# Altium project CANSwitch_V2.PrjPcb
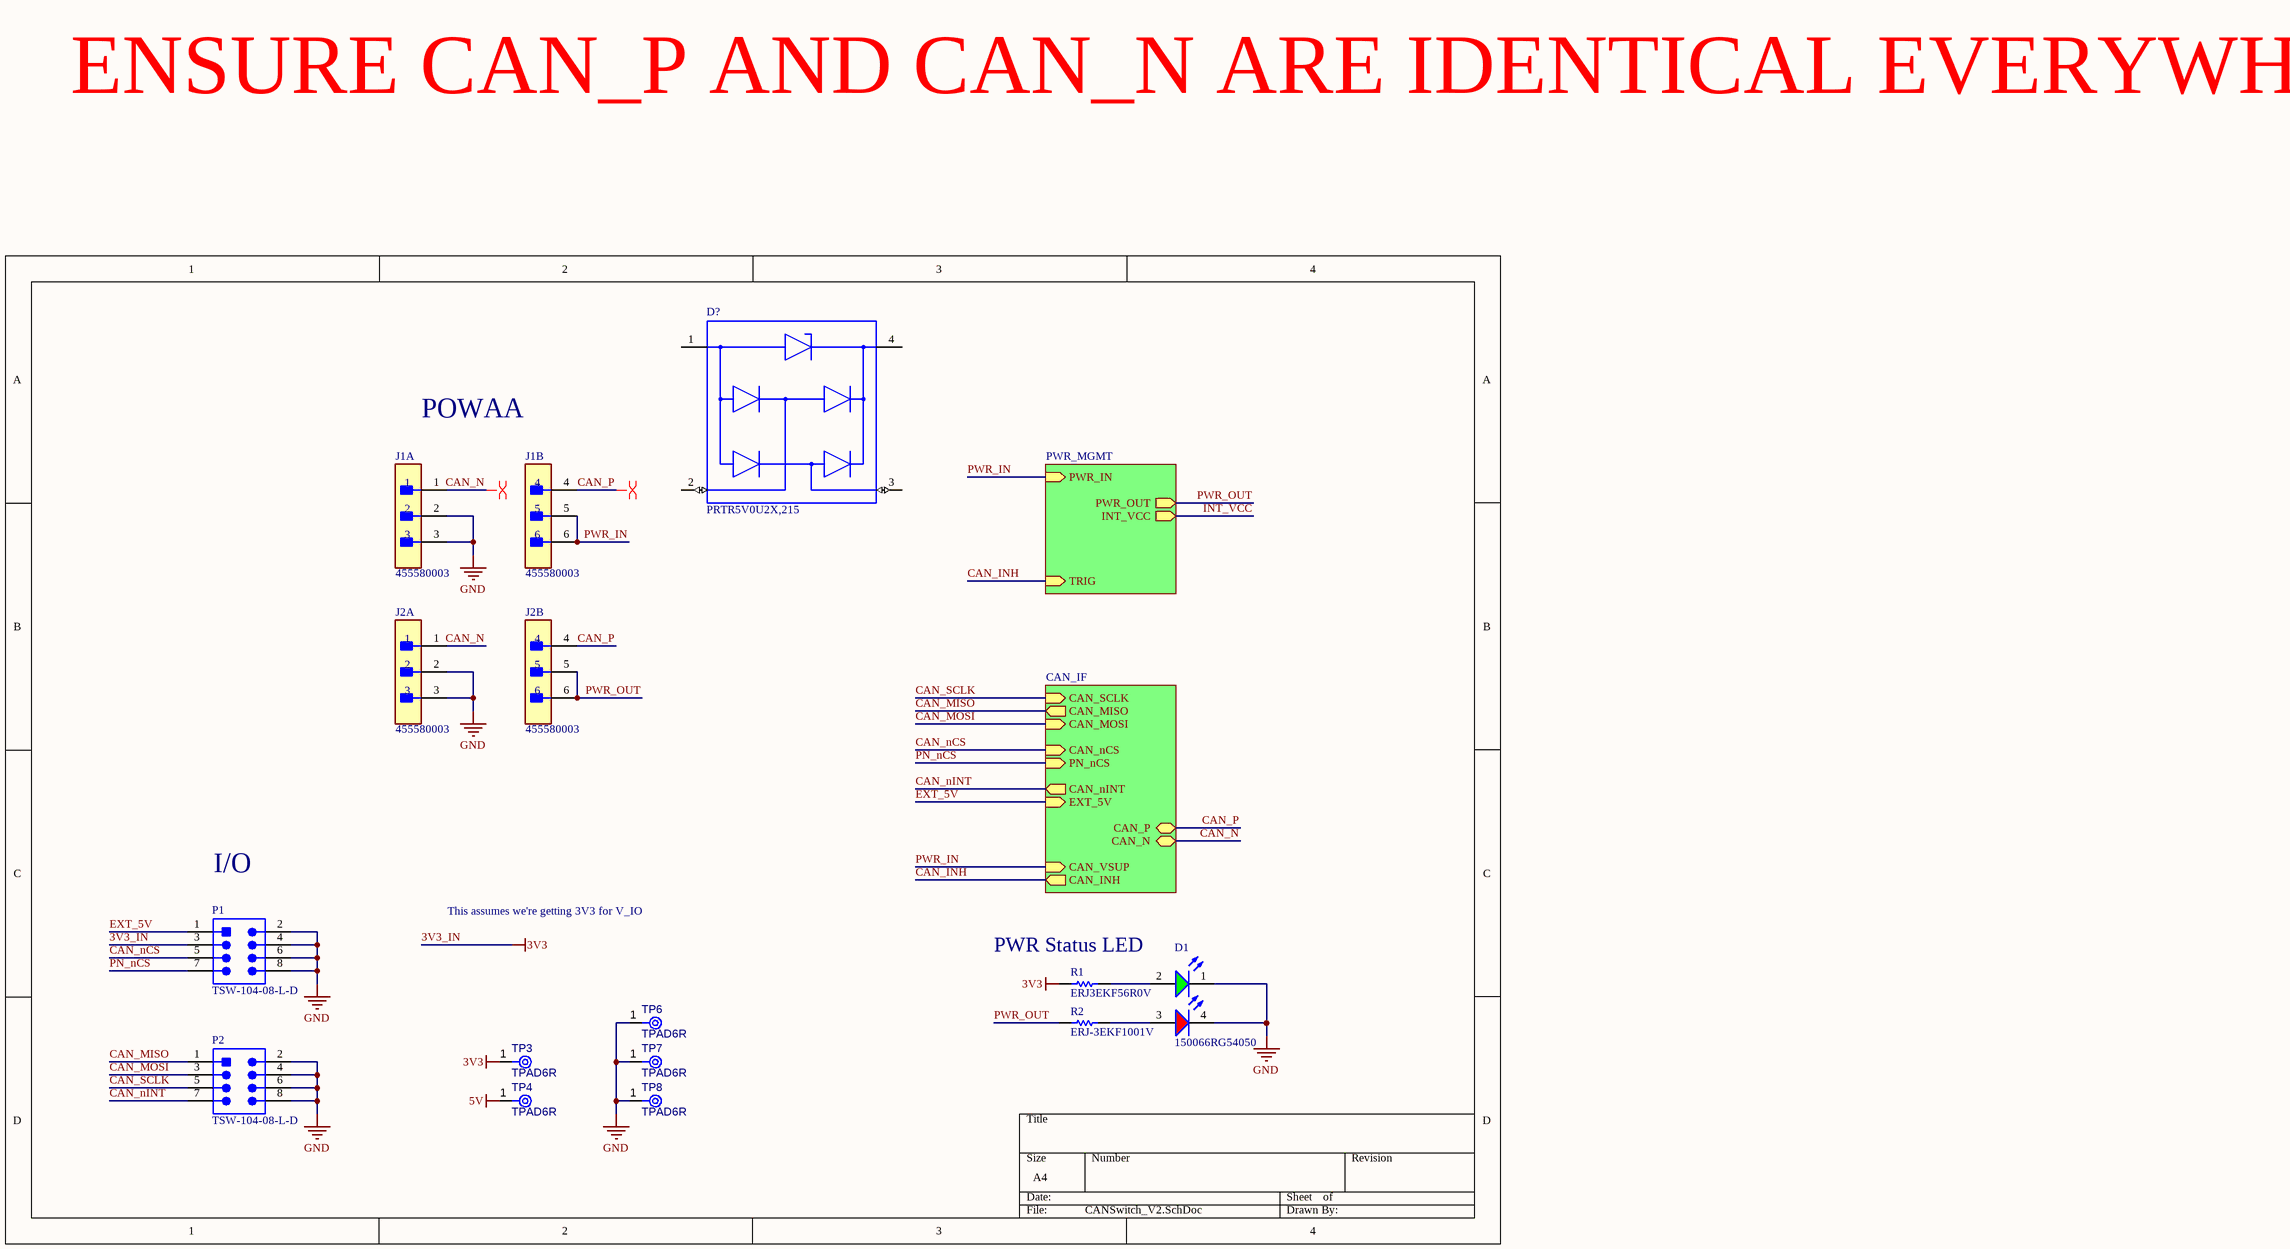
[diagram p0: CANSwitch_V2.SchDoc]
1 sheet, 13 parts. Net scope: hierarchical (ports join the sheet entries above them; power ports are global).
Board file: CANSwitch_V2.PcbDoc

## Sheet CANSwitch_V2.SchDoc
size A4; SheetNumber: 1; SheetTotal: 3

### Parts
D1  150066RG54050  [WL-SBCD_0606]
D?  PRTR5V0U2X,215  [FP-SOT143B-MFG]
J1  455580003  [FP-455580003-MFG]  (parts A,B of 2)
J2  455580003  [FP-455580003-MFG]  (parts A,B of 2)
P1  TSW-104-08-L-D  [SMTC-TSW-104-08-L-D_V]
P2  TSW-104-08-L-D  [SMTC-TSW-104-08-L-D_V]
R1  ERJ3EKF56R0V  [RESC1608X55X30NL15T15]
R2  ERJ-3EKF1001V  [RESC1608X55X30LL15T15]
TP3  TPAD6R  [TP06R]  (no BOM)
TP4  TPAD6R  [TP06R]  (no BOM)
TP6  TPAD6R  [TP06R]  (no BOM)
TP7  TPAD6R  [TP06R]  (no BOM)
TP8  TPAD6R  [TP06R]  (no BOM)

### Sub-sheets
CAN_0 = CAN_IF (file not in this document): CAN_SCLK (in), CAN_MISO (out), CAN_MOSI (in), CAN_nCS (in), CAN_INH (out), CAN_P (bidir), CAN_N (bidir), PN_nCS (in), CAN_nINT (out), EXT_5V (in), CAN_VSUP (in)
PWR_MGMT = PWR_MGMT (file not in this document): TRIG (in), PWR_OUT (out), PWR_IN (in), INT_VCC (out)

### Nets
3V3_IN: P1.3 R1.2 TP3.1(TP)  [also labelled 3V3]
5V: TP4.1(TP)
GND: D1.1(K) D1.4(K) J1.2 J1.3 J2.2 J2.3 P1.2 P1.4 P1.6 P1.8 P2.2 P2.4 P2.6 P2.8 TP6.1(TP) TP7.1(TP) TP8.1(TP)
CAN_INH: sheet CAN_0/CAN_INH, sheet PWR_MGMT/TRIG
CAN_MISO: P2.1 ; sheet CAN_0/CAN_MISO
CAN_MOSI: P2.3 ; sheet CAN_0/CAN_MOSI
CAN_N: J1.1 J2.1 ; sheet CAN_0/CAN_N
CAN_nCS: P1.5 ; sheet CAN_0/CAN_nCS
CAN_nINT: P2.7 ; sheet CAN_0/CAN_nINT
CAN_P: J1.4 J2.4 ; sheet CAN_0/CAN_P
CAN_SCLK: P2.5 ; sheet CAN_0/CAN_SCLK
EXT_5V: P1.1 ; sheet CAN_0/EXT_5V
INT_VCC: sheet PWR_MGMT/INT_VCC
PN_nCS: P1.7 ; sheet CAN_0/PN_nCS
PWR_IN: J1.5 J1.6 ; sheet CAN_0/CAN_VSUP, sheet PWR_MGMT/PWR_IN
PWR_OUT: J2.5 J2.6 R2.1 ; sheet PWR_MGMT/PWR_OUT
NetD1_2: D1.2(A) R1.1
NetD1_3: D1.3(A) R2.2

Not connected (* = marked no-connect by the designer): D? 1(GND) 2(I/O_1) 3(I/O_2) 4(VCC)

### Layout directives
differential pair: CAN_N, CAN_P

### Notes on the sheet
- ENSURE CAN_P AND CAN_N ARE IDENTICAL EVERYWHERE
- POWAA
- I/O
- This assumes we're getting 3V3 for V_IO
- (near R1) PWR Status LED

### Library data of the parts
D1 = CMP-004-00034-2: Led, Red/Grn, 180Mcd/230Mcd, 624Nm/525Nm Rohs Compliant: Yes
D? = CMP-14436-000007-1: TVS DIODE 5.5V SOT143B
J1 J2 = CMP-04776-000024-1: CONN HEADER R/A 6POS 4.2MM; Manufacturer: Molex; Standoff Height: 0.4mm; Conn Orientation: Right Angle; Number Of Contacts: 6; Conn Gender: Male; Voltage Rating: 600V; Current Rating: 8A; Footprint Url: https://www.molex.com/pdm_docs/sd/455580003_sd.pdf; Number Of Rows: 2; Lead Free: Yes; Digikey Description: CONN HEADER R/A 6POS 4.2MM; ComponentLink2URL: https://www.molex.com/webdocs/datasheets/pdf/en-us/0455580003_PCB_HEADERS.pdf; Octopart: https://octopart.com/45558-0003-molex-7672845; Package: 0; Device Class L3: unset; ComponentLink2Description: Datasheet; Device Class L2: Headers and Wire Housings; Category: Conn; Contact Material: Tin,Nickel; Mouser Description: Conn Power HDR 6 POS 4.2mm Solder ST Thru-Hole 6 Terminal 1 Port Mini-Fit Jr™ Tray; Manufacturer Part Number: 455580003; Pitch: 4.2mm; Device Class L1: Connectors; Temperature Range Low: -40°C; Temperature: -40°C to +105°C; RoHS: TRUE; Temperature Range High: +105°C; Height: 10.38mm; Automotive: No
P1 P2 = CMP-1681-00006-4: Male Header, Pitch 2.54 mm, 2 x 4 Position, Height 8.38 mm, Tail Length 5.08 mm, -55 to 125 degC, RoHS, Bulk; Manufacturer: Samtec; Voltage Rating: 550 V; Current Rating: 7.6 A; Rows: 2; ComponentLink2URL: https://datasheet.ciiva.com/25616/0900766b81154476-25616879.pdf; Package Quantity: 1; PackageDescription: Male Header, Pitch 2.54 mm, 2 x 4 Position, Height 8.38 mm, Tail Length 5.08 mm; ComponentLink1Description: Manufacturer URL; Lead Pitch: 0.1 inch; REACH SVHC: No SVHC; Mounting Technology: Through Hole; PackageReference: TSW-104-08-L-D; Contact Plating: Gold; DatasheetVersion: 04/2012; Colour: Black; Contact Finish: Gold; ComponentLink3URL: http://suddendocs.samtec.com/prints/tsw-xxx-xx-x-x-xx-xxx-footprint.pdf; ComponentLink3Description: Package Specification; Mount: Through Hole; RoHSCompliant: true; Packaging: Bulk; ComponentLink2Description: Datasheet; Contact Material: Bronze; Pins: 8; ComponentLink1URL: http://www.samtec.com/
R1 = CMP-2000-00572-1: Manufacturer: Panasonic; Part Number: ERJ3EKF56R0V
R2 = CMP-2000-00180-1: Manufacturer: Panasonic; Part Number: ERJ-3EKF1001V
TP3 TP4 TP6-TP8 = CMP-00028-00002-2: 0.6mm round; Pins: 1